# Altium schematic sheet Connectors.SchDoc: Connectors
size B; DrawnBy: Jasper Yun; SheetNumber: 2; SheetTotal: 11; Competition: SAC 2021; Subteam: Avionics; University: McGill University; Location: Montreal, Quebec; Project: Avionics Project Name; MRT: McGill Rocket Team
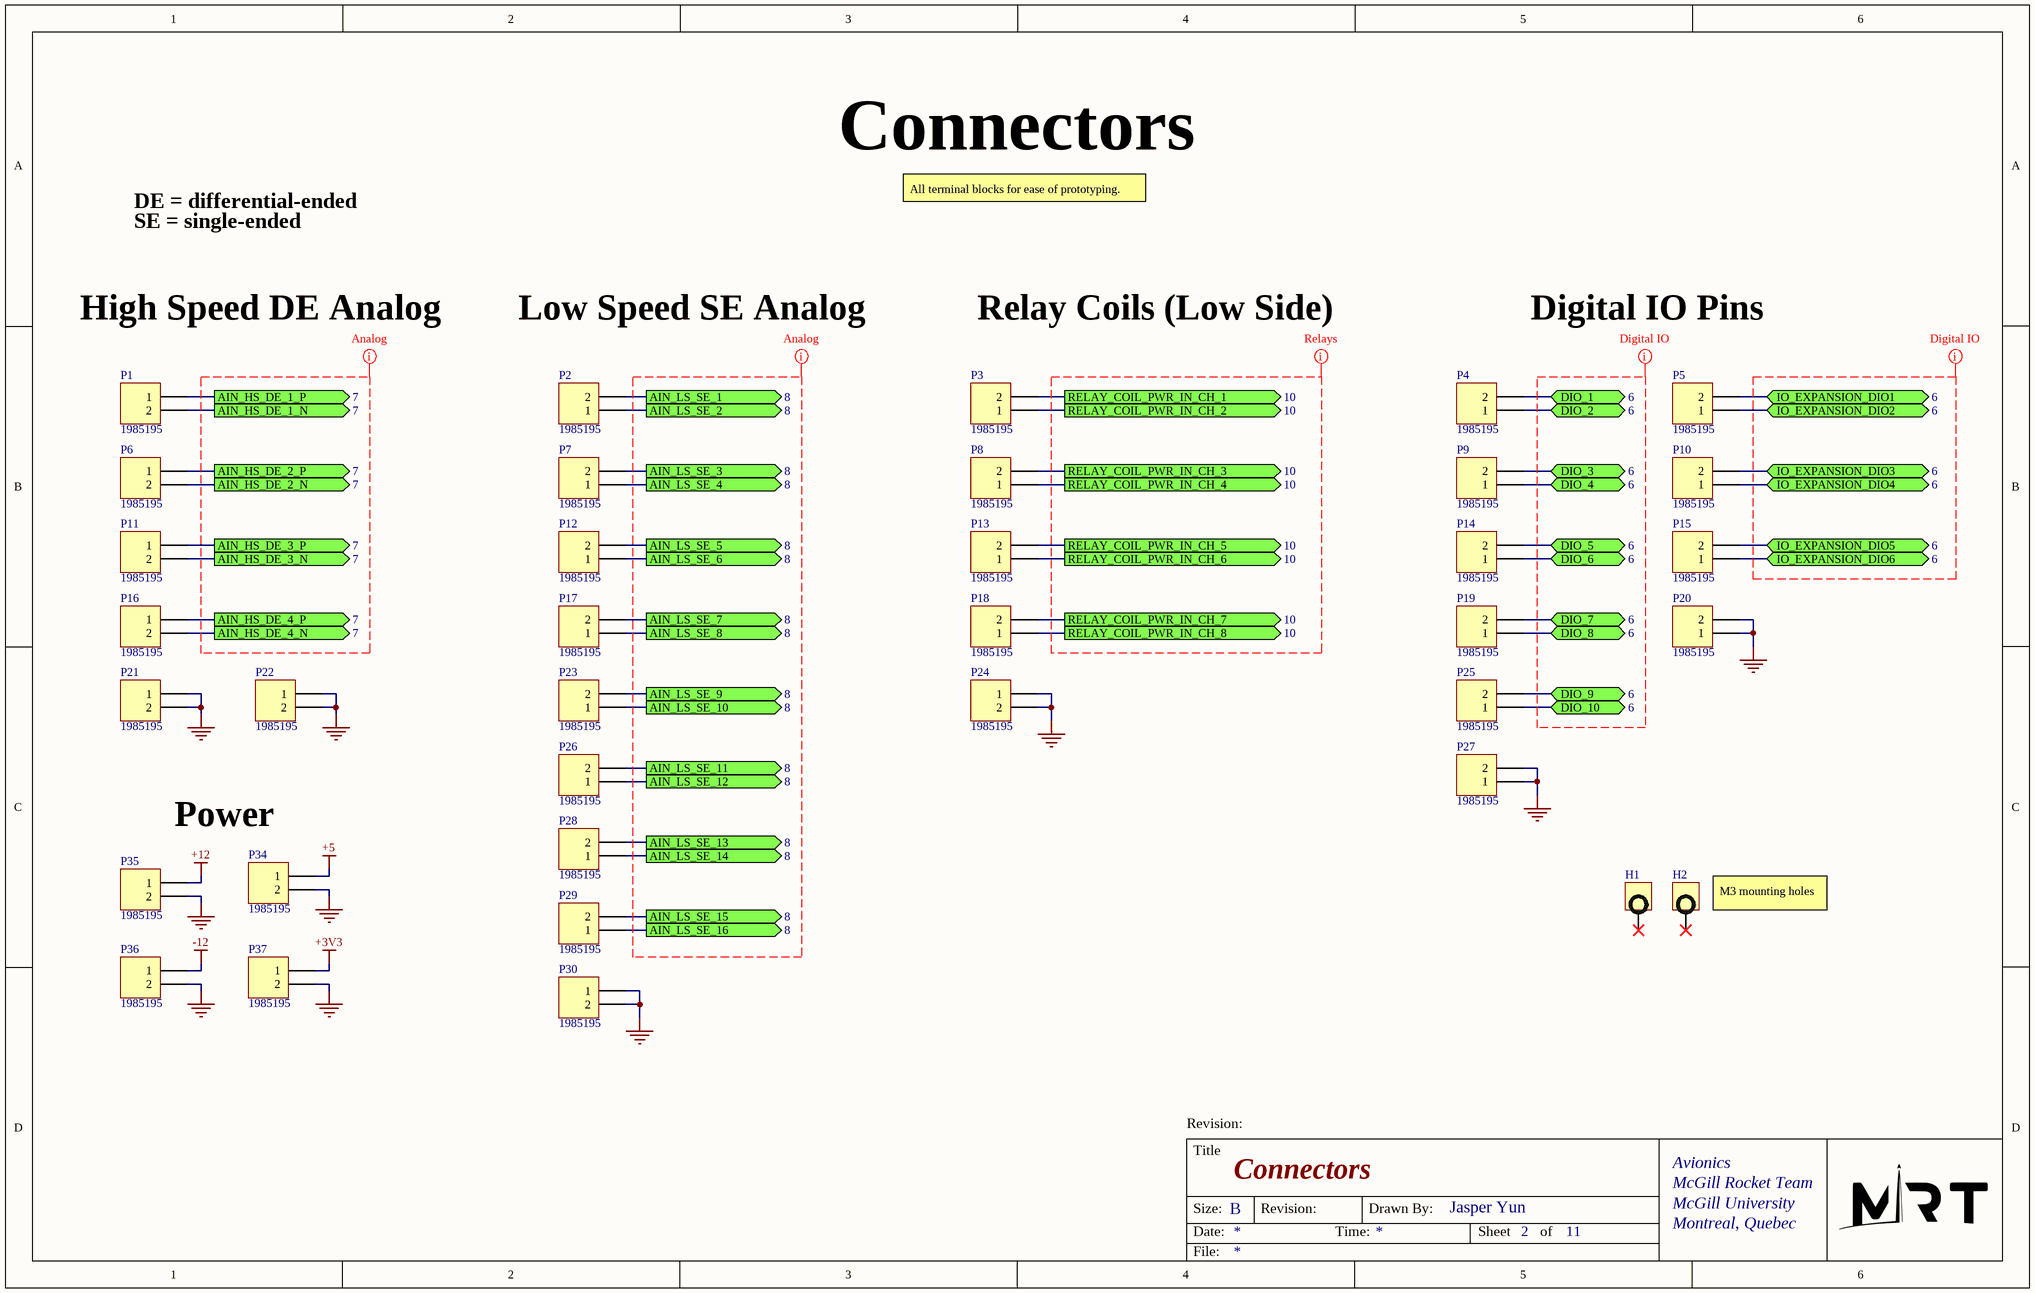
[diagram p0: Connectors.SchDoc]

## Parts
H1  M3  [HOLE M3]  (value not drawn)  (no BOM)
H2  M3  [HOLE M3]  (value not drawn)  (no BOM)
P1  1985195  [Terminal Block 1985195 2-pos 3.5mm pitch]
P2  1985195  [Terminal Block 1985195 2-pos 3.5mm pitch]
P3  1985195  [Terminal Block 1985195 2-pos 3.5mm pitch]
P4  1985195  [Terminal Block 1985195 2-pos 3.5mm pitch]
P5  1985195  [Terminal Block 1985195 2-pos 3.5mm pitch]
P6  1985195  [Terminal Block 1985195 2-pos 3.5mm pitch]
P7  1985195  [Terminal Block 1985195 2-pos 3.5mm pitch]
P8  1985195  [Terminal Block 1985195 2-pos 3.5mm pitch]
P9  1985195  [Terminal Block 1985195 2-pos 3.5mm pitch]
P10  1985195  [Terminal Block 1985195 2-pos 3.5mm pitch]
P11  1985195  [Terminal Block 1985195 2-pos 3.5mm pitch]
P12  1985195  [Terminal Block 1985195 2-pos 3.5mm pitch]
P13  1985195  [Terminal Block 1985195 2-pos 3.5mm pitch]
P14  1985195  [Terminal Block 1985195 2-pos 3.5mm pitch]
P15  1985195  [Terminal Block 1985195 2-pos 3.5mm pitch]
P16  1985195  [Terminal Block 1985195 2-pos 3.5mm pitch]
P17  1985195  [Terminal Block 1985195 2-pos 3.5mm pitch]
P18  1985195  [Terminal Block 1985195 2-pos 3.5mm pitch]
P19  1985195  [Terminal Block 1985195 2-pos 3.5mm pitch]
P20  1985195  [Terminal Block 1985195 2-pos 3.5mm pitch]
P21  1985195  [Terminal Block 1985195 2-pos 3.5mm pitch]
P22  1985195  [Terminal Block 1985195 2-pos 3.5mm pitch]
P23  1985195  [Terminal Block 1985195 2-pos 3.5mm pitch]
P24  1985195  [Terminal Block 1985195 2-pos 3.5mm pitch]
P25  1985195  [Terminal Block 1985195 2-pos 3.5mm pitch]
P26  1985195  [Terminal Block 1985195 2-pos 3.5mm pitch]
P27  1985195  [Terminal Block 1985195 2-pos 3.5mm pitch]
P28  1985195  [Terminal Block 1985195 2-pos 3.5mm pitch]
P29  1985195  [Terminal Block 1985195 2-pos 3.5mm pitch]
P30  1985195  [Terminal Block 1985195 2-pos 3.5mm pitch]
P34  1985195  [Terminal Block 1985195 2-pos 3.5mm pitch]
P35  1985195  [Terminal Block 1985195 2-pos 3.5mm pitch]
P36  1985195  [Terminal Block 1985195 2-pos 3.5mm pitch]
P37  1985195  [Terminal Block 1985195 2-pos 3.5mm pitch]

## Ports
AIN_HS_DE_1_N (out, see 7), AIN_HS_DE_1_P (out, see 7), AIN_HS_DE_2_N (out, see 7), AIN_HS_DE_2_P (out, see 7), AIN_HS_DE_3_N (out, see 7), AIN_HS_DE_3_P (out, see 7), AIN_HS_DE_4_N (out, see 7), AIN_HS_DE_4_P (out, see 7), AIN_LS_SE_1 (out, see 8), AIN_LS_SE_2 (out, see 8), AIN_LS_SE_3 (out, see 8), AIN_LS_SE_4 (out, see 8), AIN_LS_SE_5 (out, see 8), AIN_LS_SE_6 (out, see 8), AIN_LS_SE_7 (out, see 8), AIN_LS_SE_8 (out, see 8), AIN_LS_SE_9 (out, see 8), AIN_LS_SE_10 (out, see 8), AIN_LS_SE_11 (out, see 8), AIN_LS_SE_12 (out, see 8), AIN_LS_SE_13 (out, see 8), AIN_LS_SE_14 (out, see 8), AIN_LS_SE_15 (out, see 8), AIN_LS_SE_16 (out, see 8), DIO_1 (bidir, see 6), DIO_2 (bidir, see 6), DIO_3 (bidir, see 6), DIO_4 (bidir, see 6), DIO_5 (bidir, see 6), DIO_6 (bidir, see 6), DIO_7 (bidir, see 6), DIO_8 (bidir, see 6), DIO_9 (bidir, see 6), DIO_10 (bidir, see 6), IO_EXPANSION_DIO1 (bidir, see 6), IO_EXPANSION_DIO2 (bidir, see 6), IO_EXPANSION_DIO3 (bidir, see 6), IO_EXPANSION_DIO4 (bidir, see 6), IO_EXPANSION_DIO5 (bidir, see 6), IO_EXPANSION_DIO6 (bidir, see 6), RELAY_COIL_PWR_IN_CH_1 (out, see 10), RELAY_COIL_PWR_IN_CH_2 (out, see 10), RELAY_COIL_PWR_IN_CH_3 (out, see 10), RELAY_COIL_PWR_IN_CH_4 (out, see 10), RELAY_COIL_PWR_IN_CH_5 (out, see 10), RELAY_COIL_PWR_IN_CH_6 (out, see 10), RELAY_COIL_PWR_IN_CH_7 (out, see 10), RELAY_COIL_PWR_IN_CH_8 (out, see 10)

## Nets
+3V3: P37.1
+5: P34.1
+12: P35.1
-12: P36.1
GND: P20.1 P20.2 P21.1 P21.2 P22.1 P22.2 P24.1 P24.2 P27.1 P27.2 P30.1 P30.2 P34.2 P35.2 P36.2 P37.2
AIN_HS_DE_1_N: P1.2 ; port AIN_HS_DE_1_N
AIN_HS_DE_1_P: P1.1 ; port AIN_HS_DE_1_P
AIN_HS_DE_2_N: P6.2 ; port AIN_HS_DE_2_N
AIN_HS_DE_2_P: P6.1 ; port AIN_HS_DE_2_P
AIN_HS_DE_3_N: P11.2 ; port AIN_HS_DE_3_N
AIN_HS_DE_3_P: P11.1 ; port AIN_HS_DE_3_P
AIN_HS_DE_4_N: P16.2 ; port AIN_HS_DE_4_N
AIN_HS_DE_4_P: P16.1 ; port AIN_HS_DE_4_P
AIN_LS_SE_1: P2.2 ; port AIN_LS_SE_1
AIN_LS_SE_2: P2.1 ; port AIN_LS_SE_2
AIN_LS_SE_3: P7.2 ; port AIN_LS_SE_3
AIN_LS_SE_4: P7.1 ; port AIN_LS_SE_4
AIN_LS_SE_5: P12.2 ; port AIN_LS_SE_5
AIN_LS_SE_6: P12.1 ; port AIN_LS_SE_6
AIN_LS_SE_7: P17.2 ; port AIN_LS_SE_7
AIN_LS_SE_8: P17.1 ; port AIN_LS_SE_8
AIN_LS_SE_9: P23.2 ; port AIN_LS_SE_9
AIN_LS_SE_10: P23.1 ; port AIN_LS_SE_10
AIN_LS_SE_11: P26.2 ; port AIN_LS_SE_11
AIN_LS_SE_12: P26.1 ; port AIN_LS_SE_12
AIN_LS_SE_13: P28.2 ; port AIN_LS_SE_13
AIN_LS_SE_14: P28.1 ; port AIN_LS_SE_14
AIN_LS_SE_15: P29.2 ; port AIN_LS_SE_15
AIN_LS_SE_16: P29.1 ; port AIN_LS_SE_16
DIO_1: P4.2 ; port DIO_1
DIO_2: P4.1 ; port DIO_2
DIO_3: P9.2 ; port DIO_3
DIO_4: P9.1 ; port DIO_4
DIO_5: P14.2 ; port DIO_5
DIO_6: P14.1 ; port DIO_6
DIO_7: P19.2 ; port DIO_7
DIO_8: P19.1 ; port DIO_8
DIO_9: P25.2 ; port DIO_9
DIO_10: P25.1 ; port DIO_10
IO_EXPANSION_DIO1: P5.2 ; port IO_EXPANSION_DIO1
IO_EXPANSION_DIO2: P5.1 ; port IO_EXPANSION_DIO2
IO_EXPANSION_DIO3: P10.2 ; port IO_EXPANSION_DIO3
IO_EXPANSION_DIO4: P10.1 ; port IO_EXPANSION_DIO4
IO_EXPANSION_DIO5: P15.2 ; port IO_EXPANSION_DIO5
IO_EXPANSION_DIO6: P15.1 ; port IO_EXPANSION_DIO6
RELAY_COIL_PWR_IN_CH_1: P3.2 ; port RELAY_COIL_PWR_IN_CH_1
RELAY_COIL_PWR_IN_CH_2: P3.1 ; port RELAY_COIL_PWR_IN_CH_2
RELAY_COIL_PWR_IN_CH_3: P8.2 ; port RELAY_COIL_PWR_IN_CH_3
RELAY_COIL_PWR_IN_CH_4: P8.1 ; port RELAY_COIL_PWR_IN_CH_4
RELAY_COIL_PWR_IN_CH_5: P13.2 ; port RELAY_COIL_PWR_IN_CH_5
RELAY_COIL_PWR_IN_CH_6: P13.1 ; port RELAY_COIL_PWR_IN_CH_6
RELAY_COIL_PWR_IN_CH_7: P18.2 ; port RELAY_COIL_PWR_IN_CH_7
RELAY_COIL_PWR_IN_CH_8: P18.1 ; port RELAY_COIL_PWR_IN_CH_8

Not connected (* = marked no-connect by the designer): H1 1(TERMINAL)*; H2 1(TERMINAL)*

## Layout directives
net class AIN_HS_DE: (no net found under the mark)
net class AIN_LS_SE: (no net found under the mark)
net class Relays: (no net found under the mark)
net class Digital IO: (no net found under the mark)

## Notes on the sheet
- DE = differential-ended
- SE = single-ended
- All terminal blocks for ease of prototyping.
- High Speed DE Analog
- Low Speed SE Analog
- Relay Coils (Low Side)
- Digital IO Pins
- Power
- (near H2) M3 mounting holes
- Title
- Size:
- Date:
- B
- Revision:
- Time:
- Drawn By:
- Sheet
- of
- File:

## Library data of the parts
H1 H2 = Hole
P1-P30 P34-P37 = Header 2: Header, 2-Pin; LatestRevisionDate: 17-Jul-2002; LatestRevisionNote: Re-released for DXP Platform.; Publisher: Altium Limited